# Altium schematic sheet 1_P1.schdoc
size 309 x 223 mm; Symbol: Sheet-Symbol_A4; Device: Sheet-Symbol_A4; Company: 嘉立创EDA; Version: V1.0; Page Size: A4; @Project Name: #训练营#简易数字示波器+5645539A; @Page Count: 1; @Update Date: 2024-03-08; @Create Date: 2024-03-04; @Schematic Name: 简易数字示波器原理图; @Page No: 1; @Page Name: P1
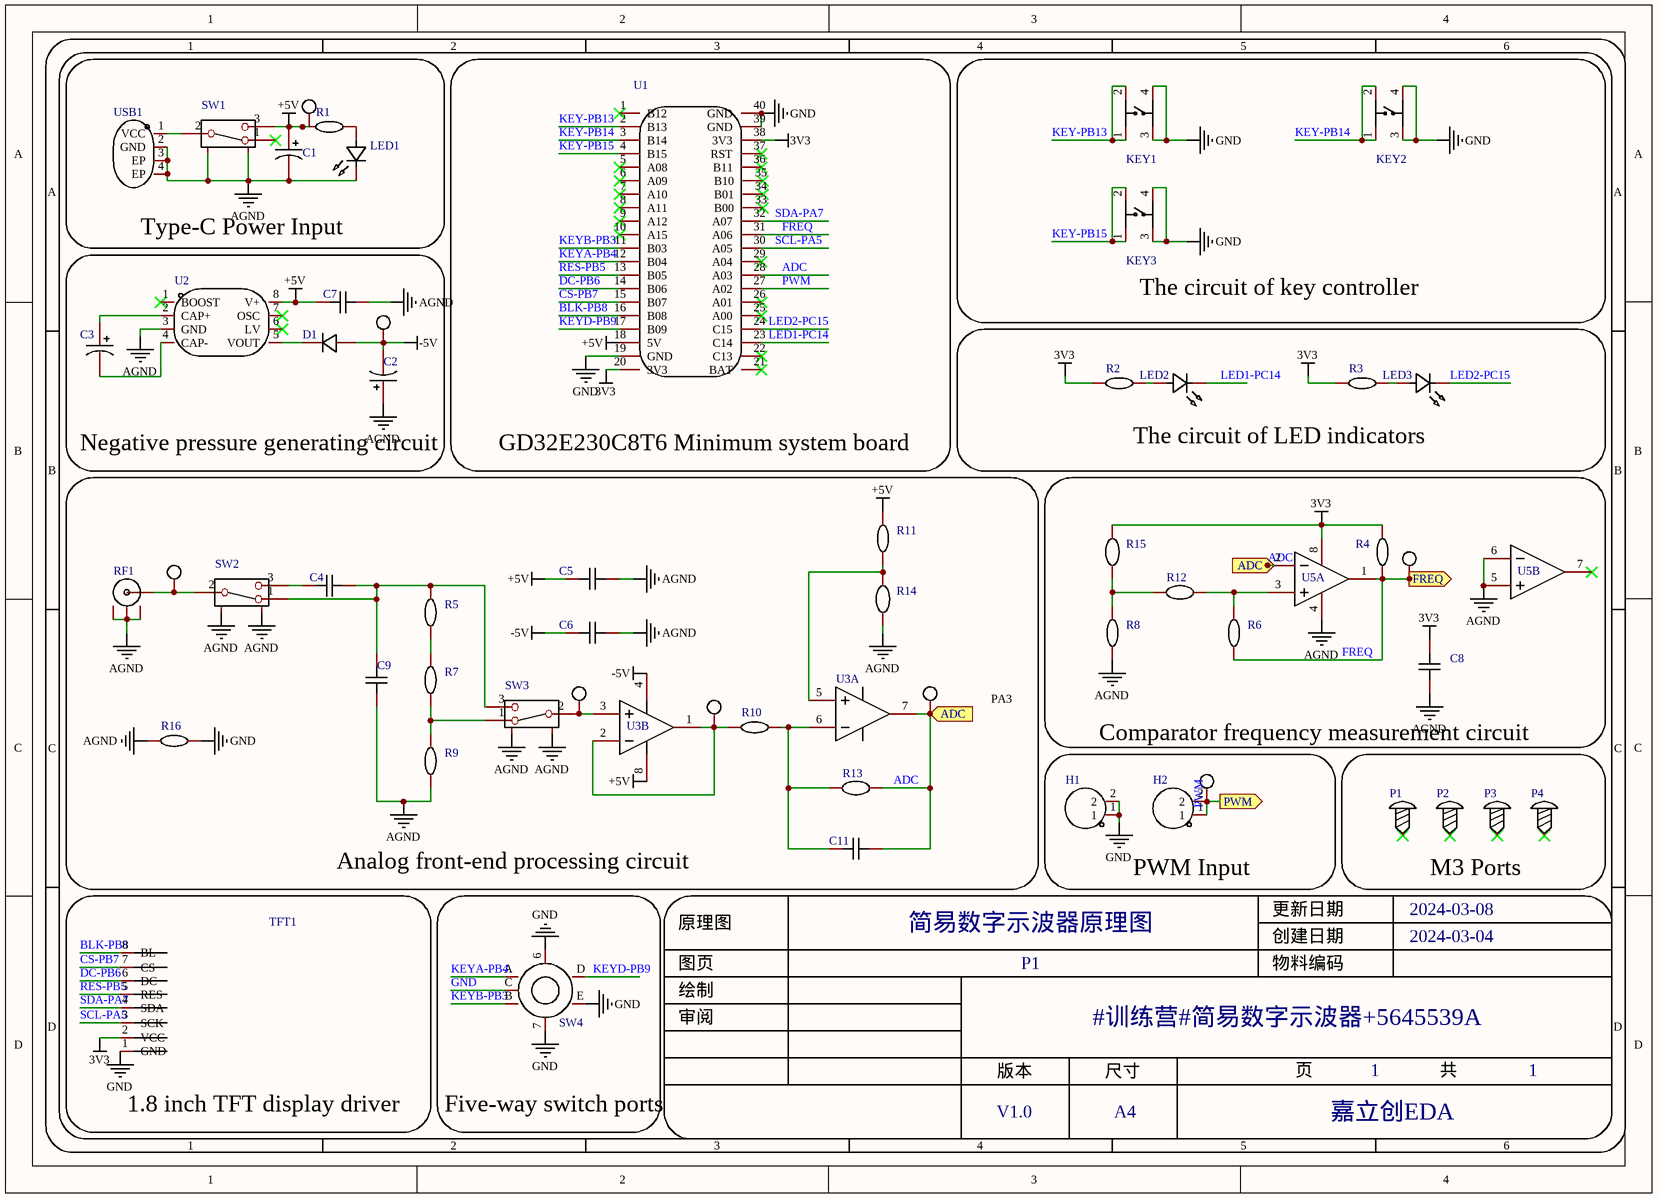
[diagram p0: 1_P1.schdoc]

## Parts
C1  10uF  [CAP-TH_BD5.0-P2.00-D0.8-FD]  (value not drawn)
C2  10uF  [CAP-TH_BD5.0-P2.00-D0.8-FD]  (value not drawn)
C3  10uF  [CAP-TH_BD5.0-P2.00-D0.8-FD]  (value not drawn)
C4  100nF  [CAP-TH_L4.2-W3.8-P2.54-D0.5]  (value not drawn)
C5  100nF  [CAP-TH_L4.2-W3.8-P2.54-D0.5]  (value not drawn)
C6  100nF  [CAP-TH_L4.2-W3.8-P2.54-D0.5]  (value not drawn)
C7  100nF  [CAP-TH_L4.2-W3.8-P2.54-D0.5]  (value not drawn)
C8  100nF  [CAP-TH_L4.2-W3.8-P2.54-D0.5]  (value not drawn)
C9  680pF  [CAP-TH_L5.5-W3.2-P5.00-D1.0]  (value not drawn)
C11  10pF  [CAP-TH_L5.5-W2.5-P5.00-D1.0]  (value not drawn)
D1  1N4148  [DO-35_BD2.0-L4.2-P8.20-D0.5-RD]  (value not drawn)
H1  B-2100S02P-A110  [HDR-TH_2P-P2.54-V-M-1]  (value not drawn)
H2  B-2100S02P-A110  [HDR-TH_2P-P2.54-V-M-1]  (value not drawn)
KEY1  TC-6610-9-260G  [SW-TH_4P-L5.0-W5.0-P4.50-LS6.5]  (value not drawn)
KEY2  TC-6610-9-260G  [SW-TH_4P-L5.0-W5.0-P4.50-LS6.5]  (value not drawn)
KEY3  TC-6610-9-260G  [SW-TH_4P-L5.0-W5.0-P4.50-LS6.5]  (value not drawn)
LED1  XL-302SURD  [LED-TH_BD3.8-P2.54-RD]  (value not drawn)
LED2  XL-304UGD  [LED-TH_BD3.8-P2.54-FD_GREEN]  (value not drawn)
LED3  XL-304UGD  [LED-TH_BD3.8-P2.54-FD_GREEN]  (value not drawn)
P1  M3螺丝  [M3螺丝]  (value not drawn)
P2  M3螺丝  [M3螺丝]  (value not drawn)
P3  M3螺丝  [M3螺丝]  (value not drawn)
P4  M3螺丝  [M3螺丝]  (value not drawn)
R1  1kΩ  [RES-TH_BD2.5-L6.5-P10.50-D0.6]  (value not drawn)
R2  1kΩ  [RES-TH_BD2.5-L6.5-P10.50-D0.6]  (value not drawn)
R3  1kΩ  [RES-TH_BD2.5-L6.5-P10.50-D0.6]  (value not drawn)
R4  1kΩ  [RES-TH_BD2.5-L6.5-P10.50-D0.6]  (value not drawn)
R5  510kΩ  [RES-TH_BD2.3-L6.5-P10.50-D0.5]  (value not drawn)
R6  510kΩ  [RES-TH_BD2.3-L6.5-P10.50-D0.5]  (value not drawn)
R7  470kΩ  [RES-TH_BD2.2-L6.5-P10.50-D0.6]  (value not drawn)
R8  20kΩ  [RES-TH_BD2.3-L6.5-P10.50-D0.5]  (value not drawn)
R9  20kΩ  [RES-TH_BD2.3-L6.5-P10.50-D0.5]  (value not drawn)
R10  20kΩ  [RES-TH_BD2.3-L6.5-P10.50-D0.5]  (value not drawn)
R11  20kΩ  [RES-TH_BD2.3-L6.5-P10.50-D0.5]  (value not drawn)
R12  10kΩ  [RES-TH_BD2.4-L6.3-P10.30-D0.6]  (value not drawn)
R13  10kΩ  [RES-TH_BD2.4-L6.3-P10.30-D0.6]  (value not drawn)
R14  10kΩ  [RES-TH_BD2.4-L6.3-P10.30-D0.6]  (value not drawn)
R15  10kΩ  [RES-TH_BD2.4-L6.3-P10.30-D0.6]  (value not drawn)
R16  0Ω  [RES-TH_BD2.3-L6.5-P10.50-D0.5]  (value not drawn)
RF1  KH-BNC50-3511  [ANT-TH_KH-BNC50-3511]  (value not drawn)
SW1  SK-12E12-G5  [SW-TH_SK-12E12-G5]  (value not drawn)
SW2  SK-12E12-G5  [SW-TH_SK-12E12-G5]  (value not drawn)
SW3  SK-12E12-G5  [SW-TH_SK-12E12-G5]  (value not drawn)
SW4  EC11L1525G01  [SW-TH_ALPS_EC11L1525G01]  (value not drawn)
TFT1  1.8 TFT 128*RGB*160  [LCD-TH_8P-P2.54-L56.0-W34.0_1.8-TFT]  (value not drawn)
U1  LC-GD32E230C8T6  [DIP-40_L53.3-W22.9-P2.54-LS15.24]  (value not drawn)
U2  XD7660  [DIP-8_L9.7-W6.4-P2.54-LS7.6-BL]  (value not drawn)
U3  TL072IP  [PDIP-8_L9.3-W6.4-P2.54-LS7.6-BL]  (value not drawn)  (parts A,B of 2)
U5  LM393N  [DIP-8_L9.7-W6.4-P2.54-LS7.6-BL]  (value not drawn)  (parts A,B of 2)
U6  TP1  [TESTPOINT-TH_BD3.2]  (value not drawn)
U7  TP2  [TESTPOINT-TH_BD3.2]  (value not drawn)
U8  TP3  [TESTPOINT-TH_BD3.2]  (value not drawn)
U9  TP5  [TESTPOINT-TH_BD3.2]  (value not drawn)
U10  TP4  [TESTPOINT-TH_BD3.2]  (value not drawn)
U11  TP6  [TESTPOINT-TH_BD3.2]  (value not drawn)
U12  TP7  [TESTPOINT-TH_BD3.2]  (value not drawn)
U13  TP8  [TESTPOINT-TH_BD3.2]  (value not drawn)
USB1  KH-TYPE-C-2P  [USB-SMD_KH-TYPE-C-2P]  (value not drawn)

## Blocks framed on the sheet
Type-C Power Input: C1 LED1 R1 SW1 U6 USB1
GD32E230C8T6 Minimum system board: U1
The circuit of key controller: KEY1-KEY3
Negative pressure generating circuit: C2 C3 C7 D1 U2 U7
The circuit of LED indicators: LED2 LED3 R2 R3
Analog front-end processing circuit: C4-C6 C9 C11 R5 R7 R9-R11 R13 R14 R16 RF1 SW2 SW3 U3 U8-U11
Comparator frequency measurement circuit: C8 R4 R6 R8 R12 R15 U5 U12
M3 Ports: P1-P4
1.8 inch TFT display driver: TFT1
Five-way switch ports: SW4

## Ports
ADC (in), FREQ (out), PWM (out)

## Nets
3V3: C8.2 R2.2 R3.2 R4.2 R15.2 TFT1.2(VCC) U1.20(3V3) U1.38(3V3) U5.8(VCC+)
+5V: C1.1 C5.1 C7.1 R1.2 R11.2 SW1.3 U1.18(5V) U2.8(V+) U3.8(VCC+) U6.1
-5V: C2.2 C6.1 D1.2(A) U3.4(VCC-) U7.1
AGND: C1.2 C2.1 C5.2 C6.2 C7.2 C8.1 C9.1 LED1.1(K) R8.1 R9.1 R14.1 R16.2 RF1.2 RF1.3 RF1.4 SW1.4 SW1.5 SW2.4 SW2.5 SW3.4 SW3.5 U2.3(GND) U5.4(VCC-) U5.5(IN2+) U5.6(IN2-) USB1.2(GND) USB1.3(EP) USB1.4(EP)
GND: H1.1 H1.2 KEY1.3 KEY1.4 KEY2.3 KEY2.4 KEY3.3 KEY3.4 R16.1 SW4.6(EH) SW4.7(EH) SW4.C SW4.E TFT1.1(GND) U1.19(GND) U1.39(GND) U1.40(GND)
ADC: C11.2 R13.2 U1.28(A03) U3.7(OUT2) U5.2(IN1-) U11.1 ; port ADC
BLK-PB8: TFT1.8(BL) U1.16(B08)
CS-PB7: TFT1.7(CS) U1.15(B07)
DC-PB6: TFT1.6(DC) U1.14(B06)
FREQ: R4.1 R6.1 U1.31(A06) U5.1(OUT1) U12.1 ; port FREQ
KEY-PB13: KEY1.1 KEY1.2 U1.2(B13)
KEY-PB14: KEY2.1 KEY2.2 U1.3(B14)
KEY-PB15: KEY3.1 KEY3.2 U1.4(B15)
KEYA-PB4: SW4.A U1.12(B04)
KEYB-PB3: SW4.B U1.11(B03)
KEYD-PB9: SW4.D U1.17(B09)
LED1-PC14: LED2.2(K) U1.23(C14)
LED2-PC15: LED3.2(K) U1.24(C15)
PWM: H2.1 H2.2 U1.27(A02) U13.1 ; port PWM
RES-PB5: TFT1.5(RES) U1.13(B05)
SCL-PA5: TFT1.3(SCK) U1.30(A05)
SDA-PA7: TFT1.4(SDA) U1.32(A07)
NetC3_1: C3.1 U2.2(CAP+)
NetC3_2: C3.2 U2.4(CAP-)
NetC4_1: C4.1 SW2.3
NetC4_2: C4.2 C9.2 R5.2 SW2.1 SW3.3
NetC11_1: C11.1 R10.2 R13.1 U3.6(IN2-)
NetD1_1: D1.1(C) U2.5(VOUT)
NetLED1_2: LED1.2(A) R1.1
NetLED2_1: LED2.1(A) R2.1
NetLED3_1: LED3.1(A) R3.1
NetR5_1: R5.1 R7.2
NetR6_2: R6.2 R12.2 U5.3(IN1+)
NetR7_1: R7.1 R9.2 SW3.1
NetR8_2: R8.2 R12.1 R15.1
NetR10_1: R10.1 U3.1(OUT1) U3.2(IN1-) U9.1
NetR11_1: R11.1 R14.2 U3.5(IN2+)
NetRF1_1: RF1.1(OUT) SW2.2 U10.1
NetSW1_2: SW1.2 USB1.1(VCC)
NetSW3_2: SW3.2 U3.3(IN1+) U8.1

Not connected (* = marked no-connect by the designer): P1 1*; P2 1*; P3 1*; P4 1*; SW1 1*; U1 1(B12)* 5(A08)* 6(A09)* 7(A10)* 8(A11)* 9(A12)* 10(A15)* 21(BAT)* 22(C13)* 25(A00)* 26(A01)* 29(A04)* 33(B00)* 34(B01)* 35(B10)* 36(B11)* 37(RST)*; U2 1(BOOST)* 6(LV)* 7(OSC)*; U5 7(OUT2)*

## Notes on the sheet
- PA3
- PWM Input
- 1
- 2
- 3
- 4
- 5
- 6
- A
- B
- C
- 原理图
- 简易数字示波器原理图
- 创建日期
- 更新日期
- 2024-03-08
- 2024-03-04
- 审阅
- 绘制
- 图页
- P1
- 物料编码
- #训练营#简易数字示波器+5645539A
- D
- 版本
- 尺寸
- 页
- 共
- V1.0
- A4
- 嘉立创EDA

## Library data of the parts
C1-C3 = 01EC1809SHC10UF50V: 容值:10uF;精度:±20%;额定电压:50V;纹波电流:50mA@120Hz;等效串联电阻:-;; Manufacturer: KNSCHA(科尼盛); Add into BOM: yes; Tolerance: ±20%; Rated Voltage: 50V; φD: 5mm; L: 11mm; Lifetime @ Temp: 5000hrs@105℃; Symbol: 01EC1809SHC10UF50V; Device: 01EC1809SHC10UF50V; Supplier: LCSC; Supplier Part: C503219; Manufacturer Part: 01EC1809SHC10UF50V; Value: 10uF; JLCPCB Part Class: 扩展库; LCSC Part Name: 10uF ±20% 50V; Supplier Footprint: 插件,D5xL11mm; Datasheet: https://atta.szlcsc.com/upload/public/pdf/source/20200324/C503219_39D1683F20D4DB1C41D8BE9142629697.pdf; Convert to PCB: yes; Ripple Current: 50mA@120Hz; Equivalent Series Resistance(ESR): -; Lead Spacing: 2mm
C4-C8 = CT4-0805B104K500F1: 容值:100nF;精度:±10%;额定电压:50V;温度系数:X7R;; Manufacturer: FH(风华); Add into BOM: yes; Tolerance: ±10%; Voltage Rated: 50V; Temperature Coefficient: X7R; Symbol: CT4-0805B104K500F1; Device: CT4-0805B104K500F1; Supplier: LCSC; Manufacturer Part: CT4-0805B104K500F1; Supplier Part: C168753; Value: 100nF; JLCPCB Part Class: 扩展库; LCSC Part Name: 100nF ±10% 50V; Supplier Footprint: 插件,P=2.54mm; Datasheet: https://atta.szlcsc.com/upload/public/pdf/source/20190402/C385200_059806A6312B28FF1421A2413EB641E1.pdf; Convert to PCB: yes
C9 = CC3A681KC1GEB45F30MF: 容值:680pF;精度:±10%;额定电压:1kV;温度系数:Y5P;; Manufacturer: Dersonic(德尔创); Add into BOM: yes; Tolerance: ±10%; Voltage Rated: 1kV; Temperature Coefficient: Y5P; φD: 5.6mm; Body Thickness: 2.8mm; Symbol: CC3A681KC1GEB45F30MF; Device: CC3A681KC1GEB45F30MF; Supplier: LCSC; Supplier Part: C377846; Manufacturer Part: CC3A681KC1GEB45F30MF; Value: 680pF; JLCPCB Part Class: 扩展库; LCSC Part Name: 680pF ±10% 1kV; Supplier Footprint: 插件,P=5.08mm; Datasheet: https://atta.szlcsc.com/upload/public/pdf/source/20200826/C377846_384F16CDCF07E0A96F27C8103F93B121.pdf; Convert to PCB: yes; Lead Spacing: 5.08mm
C11 = N06A1B100KN0B0S0N0: 容值:10pF;精度:±10%;额定电压:1kV;温度系数:NP0;; Manufacturer: STE(松田); Add into BOM: yes; Tolerance: ±10%; Voltage Rated: 1kV; Temperature Coefficient: NP0; φD: 5.5mm; Body Thickness: 2.5mm; Symbol: N06A1B100KN0B0S0N0; Device: N06A1B100KN0B0S0N0; Supplier: LCSC; Supplier Part: C260724; Manufacturer Part: N06A1B100KN0B0S0N0; Value: 10pF; JLCPCB Part Class: 扩展库; LCSC Part Name: 10pF ±10% 1kV; Supplier Footprint: 插件,P=5mm; Datasheet: https://atta.szlcsc.com/upload/public/pdf/source/20190806/C366874_7FA13009B587FE73099181E533DD7411.pdf; Convert to PCB: yes; Lead Spacing: 5mm
D1 = 1N4148_C402212: 二极管配置:-;正向压降(Vf):1V@10mA;直流反向耐压(Vr):75V;平均整流电流(Io):150mA;功率:500mW;反向恢复时间(trr):4ns;; Manufacturer: LGE(鲁光); Add into BOM: yes; Reverse Voltage (Vr): 75V; Average Rectified Current (Io): 150mA; Power Dissipation: 500mW; Reverse Leakage Current: 5uA@75V; Reverse Recovery Time (trr): 4ns; Symbol: 1N4148_C402212; Device: 1N4148_C402212; Supplier: LCSC; Supplier Part: C402212; Manufacturer Part: 1N4148; JLCPCB Part Class: 扩展库; LCSC Part Name: 电压:75V 电流:150mA; Supplier Footprint: DO-35; Datasheet: https://atta.szlcsc.com/upload/public/pdf/source/20190705/C402212_D6CD0A8EA8714742E0940C7C02C37BFA.pdf; Convert to PCB: yes; Diode Configuration: -; Forward Voltage (Vf@If): 1V@10mA; Operating Temperature: -
H1 H2 = B-2100S02P-A110: 插针结构:1x2P;间距:2.54mm;行距:-;圆针/方针:-;安装类型:直插;排数:单排;总PIN位数:2P;额定电流:-;额定电压:-;配合针长度:6mm;塑高:2.54mm;端接针长度:3mm;触头材质:黄铜;触头镀层:-;工作温度范围:-40℃~+105℃;颜色:黑色;; Manufacturer: Ckmtw(灿科盟); Symbol: 210S-1*2P L=11.6MMGold-plated black; Add into BOM: yes; Pin Structure: 1x2P; Pitch: 2.54mm; Device: B-2100S02P-A110; Supplier: LCSC; Manufacturer Part: B-2100S02P-A110; Supplier Part: C124375; JLCPCB Part Class: 扩展库; LCSC Part Name: 间距:2.54mm 1x2P 直插; Supplier Footprint: 插件,P=2.54mm; Datasheet: https://atta.szlcsc.com/upload/public/pdf/source/20221019/2EE72DAC61CAA62C0A53546E211F9C15.pdf; Convert to PCB: yes; Row Spacing: -; Circluar Pins/Square Pins: -; Mounting Type: 直插; Number of Rows: 单排; Number of Pins: 2P; Current Rating (Max): -; Voltage Rating (Max): -; Length of Mating Pin: 6mm; Insulation Height: 2.54mm; Length of End Connection Pin: 3mm; Contact Material: 黄铜; Contact Plating: -; Operating Temperature Range: -40℃~+105℃; Color: 黑色
KEY1-KEY3 = TC-6610-9-260G: 电路结构:单刀单掷;按钮形状:-;作用力:260gf;安装方式:直插;开关长度:6mm;开关宽度:6mm;开关高度:9mm;带支架:-;触点电流:50mA;额定电压(AC):-;额定电压(DC):12V;额定功率:-;绝缘电阻:100MΩ;带灯:-;机械寿命:10万次;; Manufacturer: HCTL(华灿天禄); Add into BOM: yes; Circuit: 单刀单掷; Operating Force: 260gf; Switch Length: 6mm; Switch Height: 9mm; Contact Current: 50mA; Voltage Rating (DC): 12V; Insulation Resistance: 100MΩ; Mechanical Life: 10万次; Symbol: TC-6610-9-260G; Device: TC-6610-9-260G; LCSC Part Name: 6*6*9mm 立贴 轻触开关; Supplier Part: C2845257; Manufacturer Part: TC-6610-9-260G; Supplier Footprint: 插件; JLCPCB Part Class: 扩展库; Datasheet: https://atta.szlcsc.com/upload/public/pdf/source/20230323/2FDB5D6FCE87B7593CD3E5FAC75F65D7.pdf; Supplier: LCSC; Convert to PCB: yes; Actuator Style: -; Mounting Style: 直插; Switch Width: 6mm; Strike Gundam: -; Voltage Rating (AC): -; Power Rating: -; Actuator/Cap Color: -; With Lamp: -; IP Rating: -; Pin Style: -; Operating Temperature: -
LED1 = XL-302SURD: 灯头类型:3mm圆形灯头;发光颜色:红色;功率:80mW;正向电流:30mA;主波长:615nm~620nm;透镜颜色:红色透镜;色温:-;发光角度:50°;载带方式:-;工作温度:-25℃~+85℃;; Manufacturer: XINGLIGHT(成兴光); Add into BOM: yes; Emitted Color: 红色; Power Dissipation: 80mW; Forward Current: 30mA; Peak Wavelength: 625nm; Lens Color: 红色透镜; Viewing Angle: 50°; Symbol: XL-302SURD; Device: XL-302SURD; LCSC Part Name: XL-302SURD; Supplier Part: C2895470; Manufacturer Part: XL-302SURD; Supplier Footprint: 插件,D=3mm; JLCPCB Part Class: 扩展库; Datasheet: https://atta.szlcsc.com/upload/public/pdf/source/20240112/E1E2B82945FD635E4907401DDE6D4922.pdf; Supplier: LCSC; Convert to PCB: yes; Lamp Holder Type: 3mm圆形灯头; Dominant Wavelength: 615nm~620nm; Color Temperature: -; Mounting Sytle: -; Operating Temperature: -25℃~+85℃
LED2 LED3 = XL-304UGD: 灯头类型:3mm圆形灯头;发光颜色:翠绿色;功率:80mW;正向电流:30mA;主波长:510nm~520nm;透镜颜色:绿色透镜;色温:-;发光角度:50°;载带方式:-;工作温度:-25℃~+85℃;; Manufacturer: XINGLIGHT(成兴光); Add into BOM: yes; Emitted Color: 翠绿色; Power Dissipation: 80mW; Forward Current: 30mA; Peak Wavelength: 525nm; Lens Color: 绿色透镜; Viewing Angle: 50°; Symbol: XL-304UGD; Device: XL-304UGD; LCSC Part Name: XL-304UGD; Supplier Part: C2895477; Manufacturer Part: XL-304UGD; Supplier Footprint: 插件,D=3mm; JLCPCB Part Class: 扩展库; Datasheet: https://atta.szlcsc.com/upload/public/pdf/source/20240112/E32FEE8F954556E9E1E074E24ECFCE9E.pdf; Supplier: LCSC; Convert to PCB: yes; Lamp Holder Type: 3mm圆形灯头; Dominant Wavelength: 510nm~520nm; Color Temperature: -; Mounting Sytle: -; Operating Temperature: -25℃~+85℃
P1-P4 = M3螺丝: Symbol: 螺丝孔; Convert to PCB: yes; Device: M3螺丝; Add into BOM: yes; Supplier Footprint: 插件
R1-R4 = MFR0W4F1001A50: 电阻类型:金属膜电阻;阻值:1kΩ;精度:±1%;功率:250mW;温度系数:±50ppm/℃;; Manufacturer: UNI-ROYAL(厚声); Add into BOM: yes; Tolerance: ±1%; Overload Voltage (Max): 250V; Power(Watts): 250mW; Symbol: MFR0W4F1001A50; Device: MFR0W4F1001A50; Supplier: LCSC; Manufacturer Part: MFR0W4F1001A50; Supplier Part: C57435; Value: 1kΩ; JLCPCB Part Class: 扩展库; LCSC Part Name: 1kΩ ±1% 250mW 金属膜电阻; Supplier Footprint: 插件; Datasheet: https://atta.szlcsc.com/upload/public/pdf/source/20191012/C436293_8820AA14BC71FA35E551C06C441482A0.pdf; Convert to PCB: yes; Type: 金属膜电阻; Temperature Coefficient: ±50ppm/℃
R5 R6 = MF1/4W-510KΩ±1% T: 电阻类型:金属膜电阻;阻值:510kΩ;精度:±1%;功率:250mW;温度系数:±100ppm/℃;; Manufacturer: CCO(千志电子); Symbol: MF1/4W-510KΩ±1% T52; Add into BOM: yes; Tolerance: ±1%; Overload Voltage (Max): 250V; Power(Watts): 250mW; Device: MF1/4W-510KΩ±1% T; Supplier: LCSC; Supplier Part: C119382; Manufacturer Part: MF1/4W-510KΩ±1% T; Value: 510kΩ; JLCPCB Part Class: 扩展库; LCSC Part Name: 510kΩ ±1% 250mW 金属膜电阻; Supplier Footprint: 插件,2.3x6.5mm; Datasheet: https://atta.szlcsc.com/upload/public/pdf/source/20190910/C427326_62A6D058BC0FF74963A2F22379CA06CE.pdf; Convert to PCB: yes; Type: 金属膜电阻; Temperature Coefficient: ±100ppm/℃; Operating Temperature Range: -55℃~+155℃
R7 = MFR0W4F4703A50: 电阻类型:金属膜电阻;阻值:470kΩ;精度:±1%;功率:250mW;温度系数:±50ppm/℃;; Manufacturer: UNI-ROYAL(厚声); Add into BOM: yes; Tolerance: ±1%; Overload Voltage (Max): 250V; Power(Watts): 250mW; Symbol: MFR0W4F4703A50; Device: MFR0W4F4703A50; Supplier: LCSC; Manufacturer Part: MFR0W4F4703A50; Supplier Part: C58640; Value: 470kΩ; JLCPCB Part Class: 扩展库; LCSC Part Name: 470kΩ ±1% 250mW 金属膜电阻; Supplier Footprint: 插件; Datasheet: https://atta.szlcsc.com/upload/public/pdf/source/20191012/C436293_8820AA14BC71FA35E551C06C441482A0.pdf; Convert to PCB: yes; Type: 金属膜电阻; Temperature Coefficient: ±50ppm/℃
R8-R11 R16 = MF1/4W-20KΩ±1% T: 电阻类型:金属膜电阻;阻值:20kΩ;精度:±1%;功率:250mW;温度系数:±100ppm/℃;; Manufacturer: CCO(千志电子); Symbol: MF1/4W-20KΩ±1% T52; Add into BOM: yes; Tolerance: ±1%; Overload Voltage (Max): 250V; Power(Watts): 250mW; Device: MF1/4W-20KΩ±1% T; Supplier: LCSC; Supplier Part: C119353; Manufacturer Part: MF1/4W-20KΩ±1% T; JLCPCB Part Class: 扩展库; LCSC Part Name: 20kΩ ±1% 250mW 金属膜电阻; Supplier Footprint: 插件; Datasheet: https://atta.szlcsc.com/upload/public/pdf/source/20190910/C427326_62A6D058BC0FF74963A2F22379CA06CE.pdf; Convert to PCB: yes; Type: 金属膜电阻; Temperature Coefficient: ±100ppm/℃; Operating Temperature Range: -55℃~+155℃
  R8-R11: Value: 20kΩ
  R16: Value: 0Ω
R12-R15 = RN1/4W10KFT/BA1: 电阻类型:金属膜电阻;阻值:10kΩ;精度:±1%;功率:250mW;温度系数:±50ppm/℃;; Manufacturer: Tyohm(幸亚电阻); Add into BOM: yes; Tolerance: ±1%; Overload Voltage (Max): 250V; Power(Watts): 250mW; Symbol: RN 1/4W 10K F T/B A1; Device: RN1/4W10KFT/BA1; LCSC Part Name: 10kΩ ±1% 250mW 金属膜电阻; Supplier Part: C410695; Manufacturer Part: RN1/4W10KFT/BA1; Supplier Footprint: 插件; JLCPCB Part Class: 扩展库; Datasheet: https://atta.szlcsc.com/upload/public/pdf/source/20190808/C410699_D126E64D28B638F1D73B58E9F61DFD9B.pdf; Supplier: LCSC; Convert to PCB: yes; Type: 金属膜电阻; Value: 10kΩ; Temperature Coefficient: ±50ppm/℃; Operating Temperature Range: -55℃~+125℃
RF1 = KH-BNC50-3511: 连接器类型:板端;接口类型:内孔;端口数量:1;接口直径:9.5mm;接口长度/高度:-;频率-最大值:3GHz;射频系列:BNC;阻抗:50Ω;样式:弯头;工作温度范围:-55℃~+155℃;; Manufacturer: kinghelm(金航标); Add into BOM: yes; Connector Type: 板端; Interface Type: 内孔; Number of Ports: 1; Interface Diameter: 9.5mm; Frequency-Max: 3GHz; RF Series: BNC; Impedance: 50Ω; Style: 弯头; Symbol: KH-BNC50-3511; Device: KH-BNC50-3511; Supplier: LCSC; Supplier Part: C2837587; Manufacturer Part: KH-BNC50-3511; JLCPCB Part Class: 扩展库; LCSC Part Name: BNC 内孔 弯头; Supplier Footprint: 插件; Datasheet: https://atta.szlcsc.com/upload/public/pdf/source/20221123/AFF24A942BB0EF6B7776F494013BE75C.pdf; Convert to PCB: yes; Interface Length/Height: -; Operating Temperature Range: -55℃~+155℃
SW1-SW3 = SK-12E12-G5: 电路结构:单刀双掷;安装方式:侧插;额定电流(DC):-;额定电压(DC):-;额定电流(AC):-;额定电压(AC):-;机械寿命:5千次;; Manufacturer: 韩国韩荣; Add into BOM: yes; Circuit: 单刀双掷; Actuator Style: 矩形柱状; Pin Style: PC引脚; Switch Height: 10.6mm; Mechanical Life: 5千次; Symbol: SK-12E12-G5; Device: SK-12E12-G5; LCSC Part Name: 卧插双档 滑动开关; Supplier Part: C136720; Manufacturer Part: SK-12E12-G5; Supplier Footprint: 插件; JLCPCB Part Class: 扩展库; Datasheet: https://atta.szlcsc.com/upload/public/pdf/source/20210810/880D64C2F8CCE477762EFCC00B7B7681.pdf; Supplier: LCSC; Convert to PCB: yes; Mounting Style: 侧插; Current Rating (DC): -; Voltage Rating (DC): -; Current Rating (AC): -; Voltage Rating (AC): -; Operating Temperature: -25℃~+70℃
SW4 = EC11L1525G01: Manufacturer: ALPSALPINE(阿尔卑斯阿尔派); Add into BOM: yes; Symbol: EC11L1525G01; Device: EC11L1525G01; LCSC Part Name: EC11L1525G01; Supplier Part: C2991196; Manufacturer Part: EC11L1525G01; Supplier Footprint: 插件; JLCPCB Part Class: 扩展库; Datasheet: https://atta.szlcsc.com/upload/public/pdf/source/20220411/178C78D91D042177C355D008FA29ADBD.pdf; Supplier: LCSC; Convert to PCB: yes
TFT1 = 1.8 TFT 128*RGB*160: Add into BOM: yes; Symbol: 1.8 TFT 128*RGB*160; Device: 1.8 TFT 128*RGB*160; LCSC Part Name: 1.8 TFT 128*RGB*160; Supplier Part: C9900080251; Manufacturer Part: 1.8 TFT 128*RGB*160; Supplier Footprint: 插件; Supplier: LCSC; Convert to PCB: yes
U1 = LC-GD32E230C8T6: 4件套; Manufacturer: 立创开发板; Add into BOM: yes; Symbol: LC-GD32E230C8T6; Device: LC-GD32E230C8T6; LCSC Part Name: 立创·GD32E230C8T6开发板 4件套; Supplier Part: C20068939; Manufacturer Part: LC-GD32E230C8T6; Supplier Footprint: -; Datasheet: https://atta.szlcsc.com/upload/public/pdf/source/20231228/B8D3B414FEF73ED047C032DDAFCF7037.pdf; Supplier: LCSC; Convert to PCB: yes
U2 = XD7660: 电荷泵 同步整流：否 输出通道数：1 输入电压：1.5V~12V 输出电压：-12V~-1.5V 输出电流(最大值)：45mA 开关频率：35kHz 芯片 电压转换器 50/管 初级输入电压: 12V 输出数: 1 输出电压: 22.8V 输出电流: 20mA; Manufacturer: XINLUDA(信路达); Add into BOM: yes; Symbol: XD7660; Device: XD7660; LCSC Part Name: XD7660; Supplier Part: C521200; Manufacturer Part: XD7660; Supplier Footprint: DIP-8; JLCPCB Part Class: 扩展库; Datasheet: https://atta.szlcsc.com/upload/public/pdf/source/20231018/4068EFC3A01C8F12E5E8C16122410E62.pdf; Supplier: LCSC; Convert to PCB: yes
U3 = TL072IP: 放大器数:双路;增益带宽积(GBP):5.25MHz;输入偏置电流(Ib):65pA;输入失调电压(Vos):3mV;压摆率(SR):13V/us;; Manufacturer: TI(德州仪器); Add into BOM: yes; Number of Circuits: 双路; Current - Input Bias(Ib): 65pA; Voltage - Input Offset(Vos): 3mV; Slew Rate(SR): 13V/us; Supply Current Per Channel: 1.4mA; Symbol: TL072IP; Device: TL072IP; LCSC Part Name: TL072IP; Supplier Part: C110329; Manufacturer Part: TL072IP; Supplier Footprint: PDIP-8; JLCPCB Part Class: 扩展库; Datasheet: https://www.ti.com/cn/lit/gpn/tl072; Supplier: LCSC; Convert to PCB: yes; Gain Bandwidth Product(GBP): 5.25MHz; Operating Temperature: -40℃~+85℃
U5 = LM393N: Manufacturer: HGSEMI(华冠); Add into BOM: yes; Symbol: LM393N; Device: LM393N; LCSC Part Name: 双路差动比较器; Supplier Part: C725322; Manufacturer Part: LM393N; Supplier Footprint: DIP-8; JLCPCB Part Class: 扩展库; Datasheet: https://atta.szlcsc.com/upload/public/pdf/source/20200820/C725322_C46EBBBE971B817B9F055C15254D1754.pdf; Supplier: LCSC; Convert to PCB: yes
U6-U13 = TP-黄色测试点: Add into BOM: yes; Symbol: TP-黄色测试点; Device: TP-黄色测试点; LCSC Part Name: TP-黄色测试点; Supplier Part: C9900007422; Supplier Footprint: TESTPOINT-TH_BD-2P-P2.00; JLCPCB Part Class: 扩展库; Supplier: LCSC; Convert to PCB: yes
  U6: Manufacturer Part: TP1
  U7: Manufacturer Part: TP2
  U8: Manufacturer Part: TP3
  U9: Manufacturer Part: TP5
  U10: Manufacturer Part: TP4
  U11: Manufacturer Part: TP6
  U12: Manufacturer Part: TP7
  U13: Manufacturer Part: TP8
USB1 = KH-TYPE-C-2P: 连接器类型:Type-C;标准:-;公母:-;端口数量:-;触点数量:2P;安装方式:-;额定电流 - 电源:-;触头材质:-;触头镀层:-;工作温度范围:-;; Manufacturer: kinghelm(金航标); Add into BOM: yes; Connector Type: Type-C; Number of Contacts: 2P; Symbol: KH-TYPE-C-2P; Device: KH-TYPE-C-2P; LCSC Part Name: Type-C; Supplier Part: C2919656; Manufacturer Part: KH-TYPE-C-2P; Supplier Footprint: 插件; JLCPCB Part Class: 扩展库; Datasheet: https://atta.szlcsc.com/upload/public/pdf/source/20220707/620587A9E0589B27D96D3CEE595CBC98.pdf; Supplier: LCSC; Convert to PCB: yes; Standard: -; Gender: -; Number of Ports: -; Mounting Style: -; Current Rating - Power (Max): -; Contact Material: -; Contact Plating: -; Operating Temperature Range: -